# EasyEDA schematic schematic.json
TITLE: Airplane; REV: 1.0; Date: 2021-09-14; Sheet: 1/1; Company: Boeing
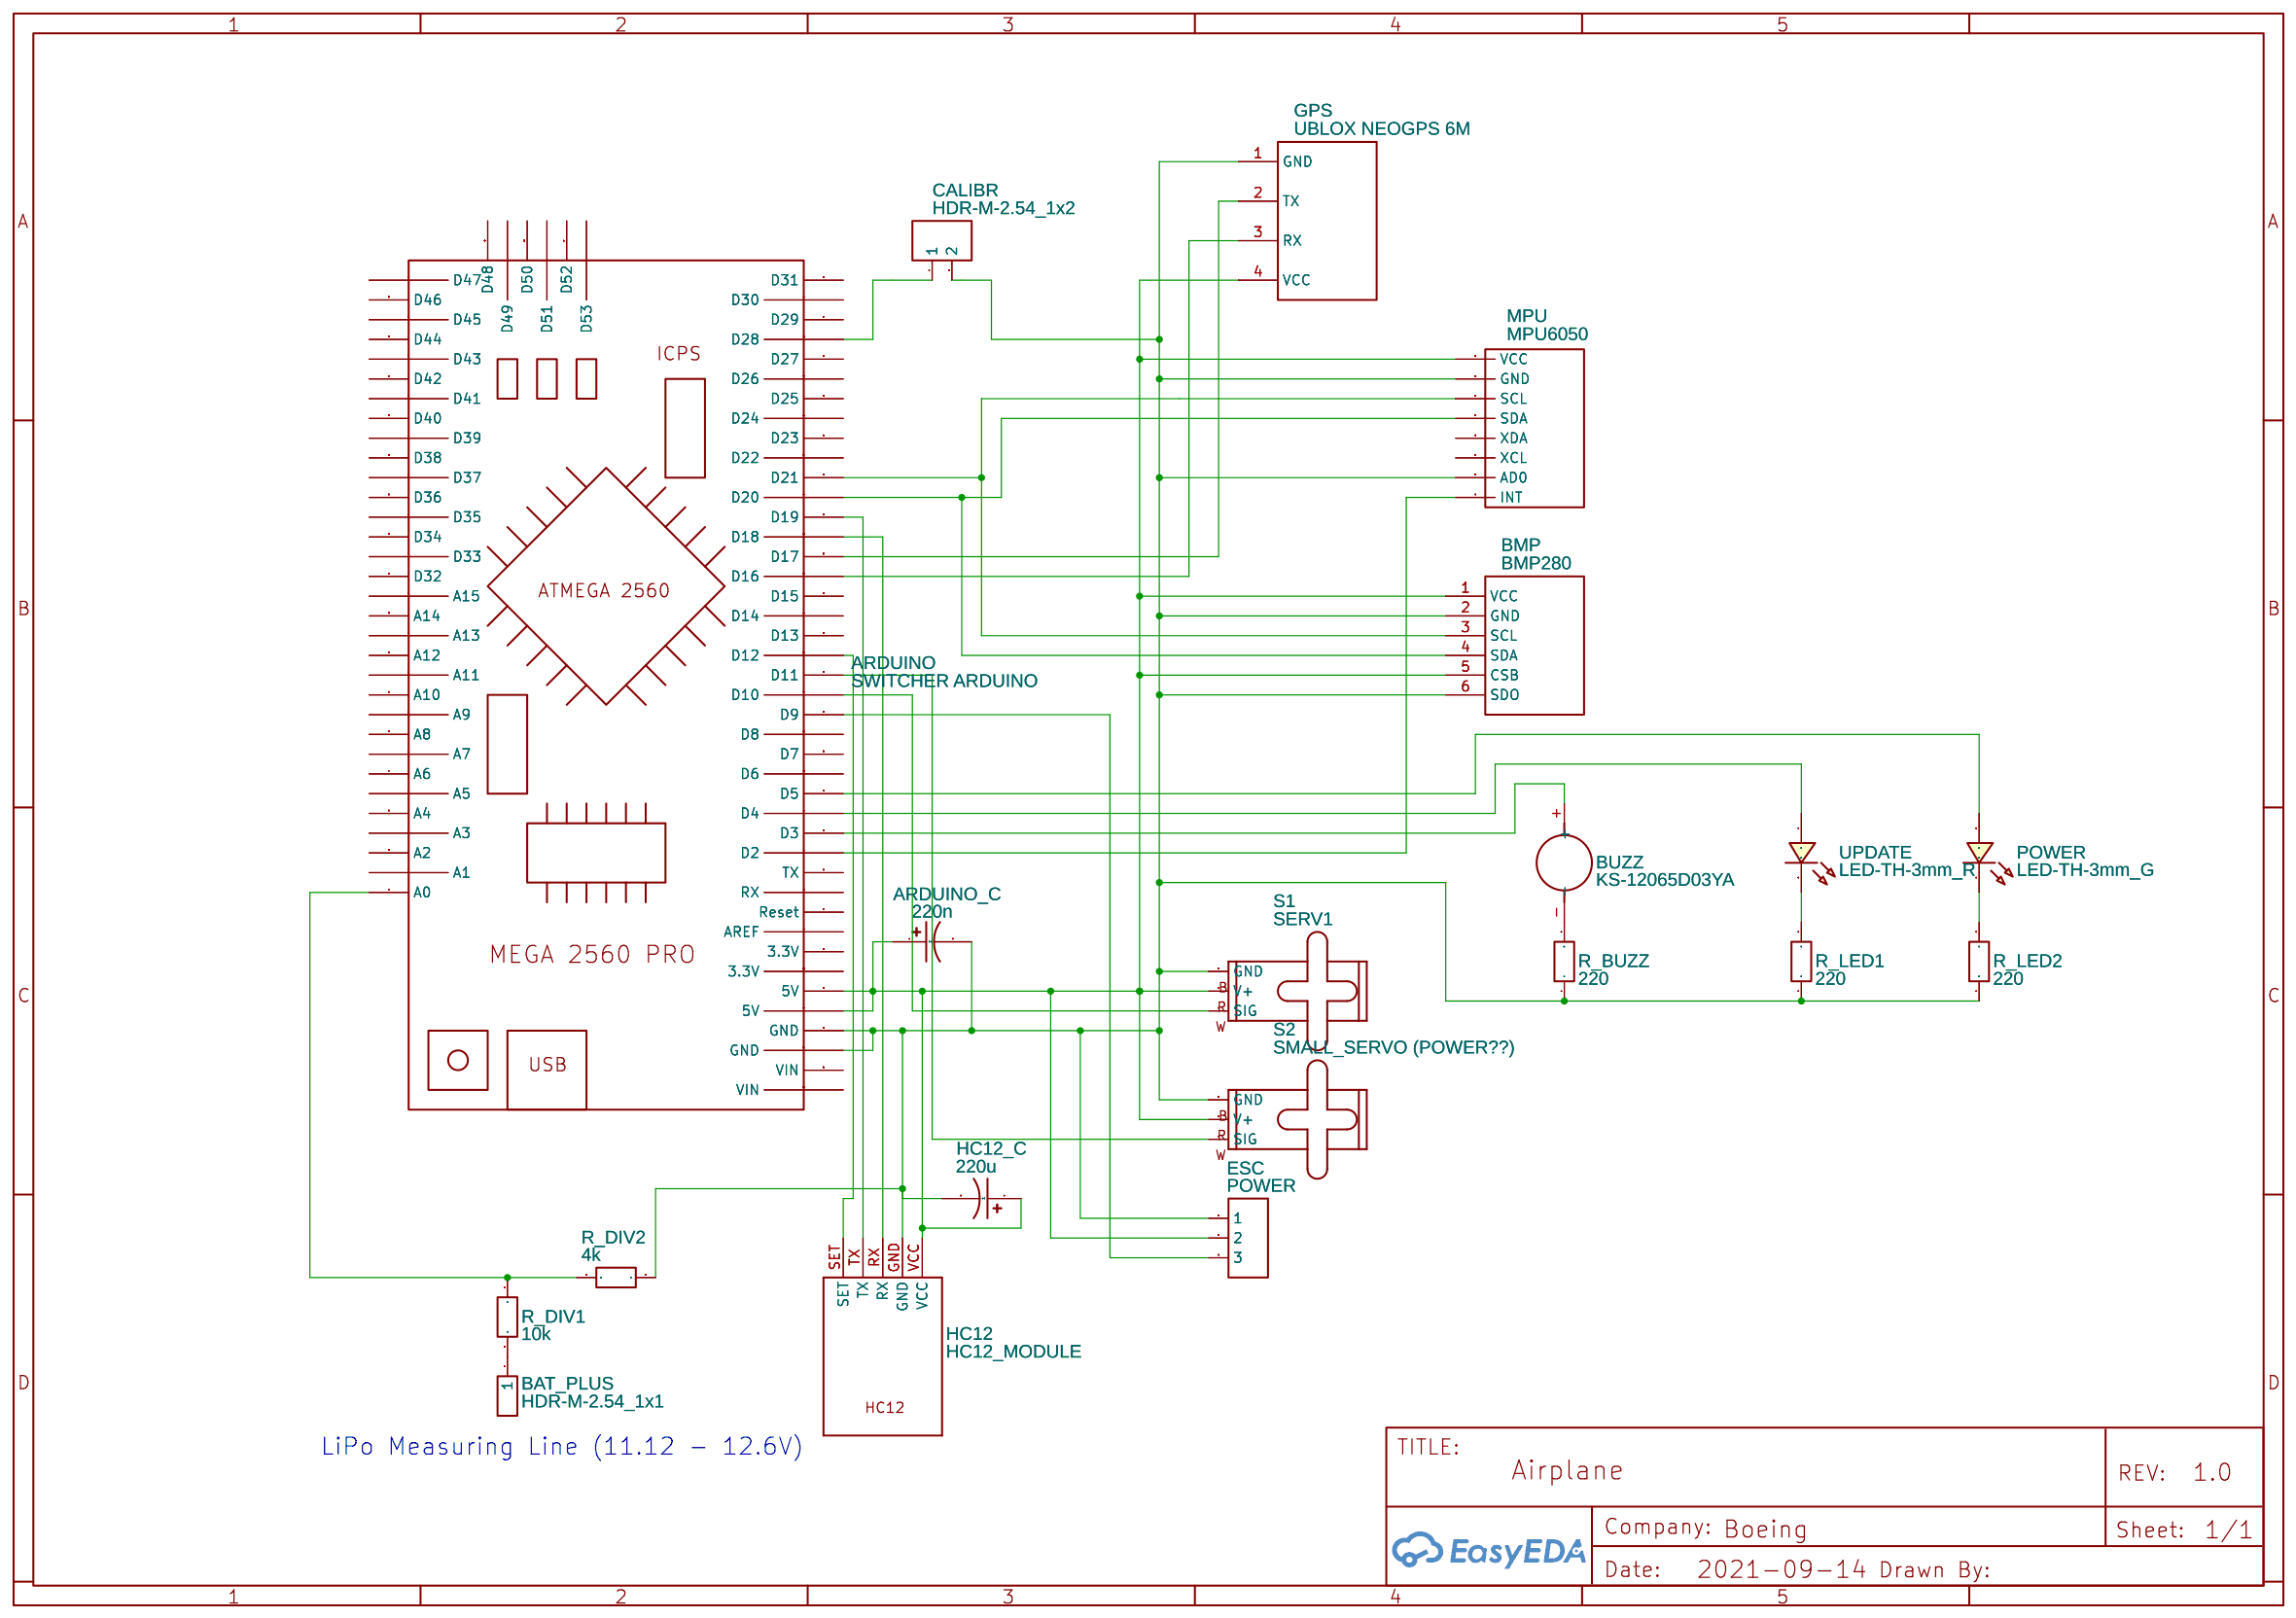
[diagram p0: schematic sheet]

## Parts
ARDUINO  SWITCHER ARDUINO  [ARDUINO MEGA 2560 PRO]
ARDUINO_C  220n  [CAP-D3.0×F1.5]
BAT_PLUS  HDR-M-2.54_1x1  [HDR-M-2.54_1X1]
BMP  BMP280  [BMP280]
BUZZ  KS-12065D03YA  [BZ2-7.6-D12.0XH6.5MM]
CALIBR  HDR-M-2.54_1x2  [HDR-M-2.54_1X2]
ESC  POWER  [HDR-M-2.54_1X3]
GPS  UBLOX NEOGPS 6M  [NEO6M_MODULE]
HC12  HC12_MODULE  [HC12]
HC12_C  220u  [CAP-D3.0×F1.5]
MPU  MPU6050  [MPU6050 MODULE]
POWER  LED-TH-3mm_G  [LED-TH_BD3.0_GREEN]
R_BUZZ  220  [R_AXIAL-0.3]
R_DIV1  10k  [R_AXIAL-0.3]
R_DIV2  4k  [R_AXIAL-0.3]
R_LED1  220  [R_AXIAL-0.3]
R_LED2  220  [R_AXIAL-0.3]
S1  SERV1  [1X03]
S2  SMALL_SERVO (POWER??)  [1X03]
UPDATE  LED-TH-3mm_R  [LED-TH_BD3.0_RED]

## Library data of the parts
ARDUINO = SWITCHER ARDUINO: Manufacturer Part: Arduino Mega 2560 Pro Mini; link: https://www.arduino.cc; Contributor: Tiet Gan Ong
ARDUINO_C HC12_C = CE_TH_D3.0×F1.5_US: Contributor: LCEDA_Lib
BAT_PLUS = HDR-M-2.54_1x1: Supplier Part: C81276; Supplier: LCSC; Contributor: LCEDA_Lib
BMP = BMP280: Manufacturer Part: MPU-6050; Contributor: Axbri
BUZZ = KS-12065D03YA: DIP Buzzer 3V-30mA- 2700
CALIBR = HDR-M-2.54_1x2: Supplier Part: C124375; Supplier: LCSC; Contributor: LCEDA_Lib
ESC = HDR-M-2.54_1x3: Supplier Part: C180248; Supplier: LCSC; Contributor: LCEDA_Lib
GPS = UBLOX NEOGPS 6M: Supplier: aliexpress; Contributor: Leo Hofer
HC12 = HC12_MODULE: Contributor: Lionelo
MPU = MPU6050: sourceId: 1T5FDZYC8; Contributor: Filip
POWER = LED-TH-3mm_G: Manufacturer: EVERLIGHT(台湾亿光); Manufacturer Part: 204-10SYGD/S530-E3; Supplier Part: C85161; Contributor: LCEDA_Lib
R_BUZZ R_DIV1 R_DIV2 R_LED1 R_LED2 = R_AXIAL-0.3_EU: Contributor: LCEDA_Lib
S1 S2 = SMALL_SERVO: Small servo motor; Contributor: SparkFun
UPDATE = LED-TH-3mm_R: Manufacturer: EVERLIGHT(台湾亿光); Manufacturer Part: 204-10SDRD/S530-A3-L; Supplier Part: C84774; Supplier: LCSC; Contributor: LCEDA_Lib

## Nets
Net-(ARDUINO-1): ARDUINO.1(A0) R_DIV1.1 R_DIV2.2
Net-(ARDUINO-48): ARDUINO.48(D28) CALIBR.1
Net-(ARDUINO-55): ARDUINO.55(D21) BMP.3(SCL) MPU.SCL
Net-(ARDUINO-56): ARDUINO.56(D20) BMP.4(SDA) MPU.SDA
Net-(ARDUINO-57): ARDUINO.57(D19) HC12.TX
Net-(ARDUINO-58): ARDUINO.58(D18) HC12.RX
Net-(ARDUINO-59): ARDUINO.59(D17) GPS.2(TX)
Net-(ARDUINO-60): ARDUINO.60(D16) GPS.3(RX)
Net-(ARDUINO-64): ARDUINO.64(D12) HC12.SET
Net-(ARDUINO-65): ARDUINO.65(D11) S2.1(SIG)
Net-(ARDUINO-66): ARDUINO.66(D10) S1.1(SIG)
Net-(ARDUINO-67): ARDUINO.67(D9) ESC.3
Net-(ARDUINO-71): ARDUINO.71(D5) POWER.1
Net-(ARDUINO-72): ARDUINO.72(D4) UPDATE.1
Net-(ARDUINO-73): ARDUINO.73(D3) BUZZ.+
Net-(ARDUINO-74): ARDUINO.74(D2) MPU.INT
Net-(ARDUINO-81): ARDUINO.81(5V) ARDUINO.82(5V) ARDUINO_C.1 BMP.1(VCC) BMP.5(CSB) ESC.2 GPS.4(VCC) HC12.VCC HC12_C.1 MPU.VCC S1.2(V+) S2.2(V+)
Net-(ARDUINO-83): ARDUINO.83(GND) ARDUINO.84(GND) ARDUINO_C.2 BMP.2(GND) BMP.6(SDO) CALIBR.2 ESC.1 GPS.1(GND) HC12.GND HC12_C.2 MPU.AD0 MPU.GND R_BUZZ.1 R_DIV2.1 R_LED1.1 R_LED2.1 S1.3(GND) S2.3(GND)
Net-(BAT_PLUS-1): BAT_PLUS.1 R_DIV1.2
Net-(BUZZ--): BUZZ.- R_BUZZ.2
Net-(POWER-2): POWER.2 R_LED2.2
Net-(R_LED1-2): R_LED1.2 UPDATE.2

Not connected (* = marked no-connect by the designer): ARDUINO 2(A1) 3(A2) 4(A3) 5(A4) 6(A5) 7(A6) 8(A7) 9(A8) 10(A9) 11(A10) 12(A11) 13(A12) 14(A13) 15(A14) 16(A15) 17(D32) 18(D33) 19(D34) 20(D35) 21(D36) 22(D37) 23(D38) 24(D39) 25(D40) 26(D41) 27(D42) 28(D43) 29(D44) 30(D45) 31(D46) 32(D47) 33(D48) 34(D49) 35(D50) 36(D51) 37(D52) 38(D53) 45(D31) 46(D30) 47(D29) 49(D27) 50(D26) 51(D25) 52(D24) 53(D23) 54(D22) 61(D15) 62(D14) 63(D13) 68(D8) 69(D7) 70(D6) 75(TX) 76(RX) 77(Reset) 78(AREF) 79(3.3V) 80(3.3V) 85(VIN) 86(VIN); MPU XCL XDA

## Notes on the sheet
- LiPo Measuring Line (11.12 - 12.6V)
